# Altium schematic sheet 配套实验板原理图.SchDoc: 单片机综合实验板
size A3; Author: 王东锋; Organization: 空军第一航空学院
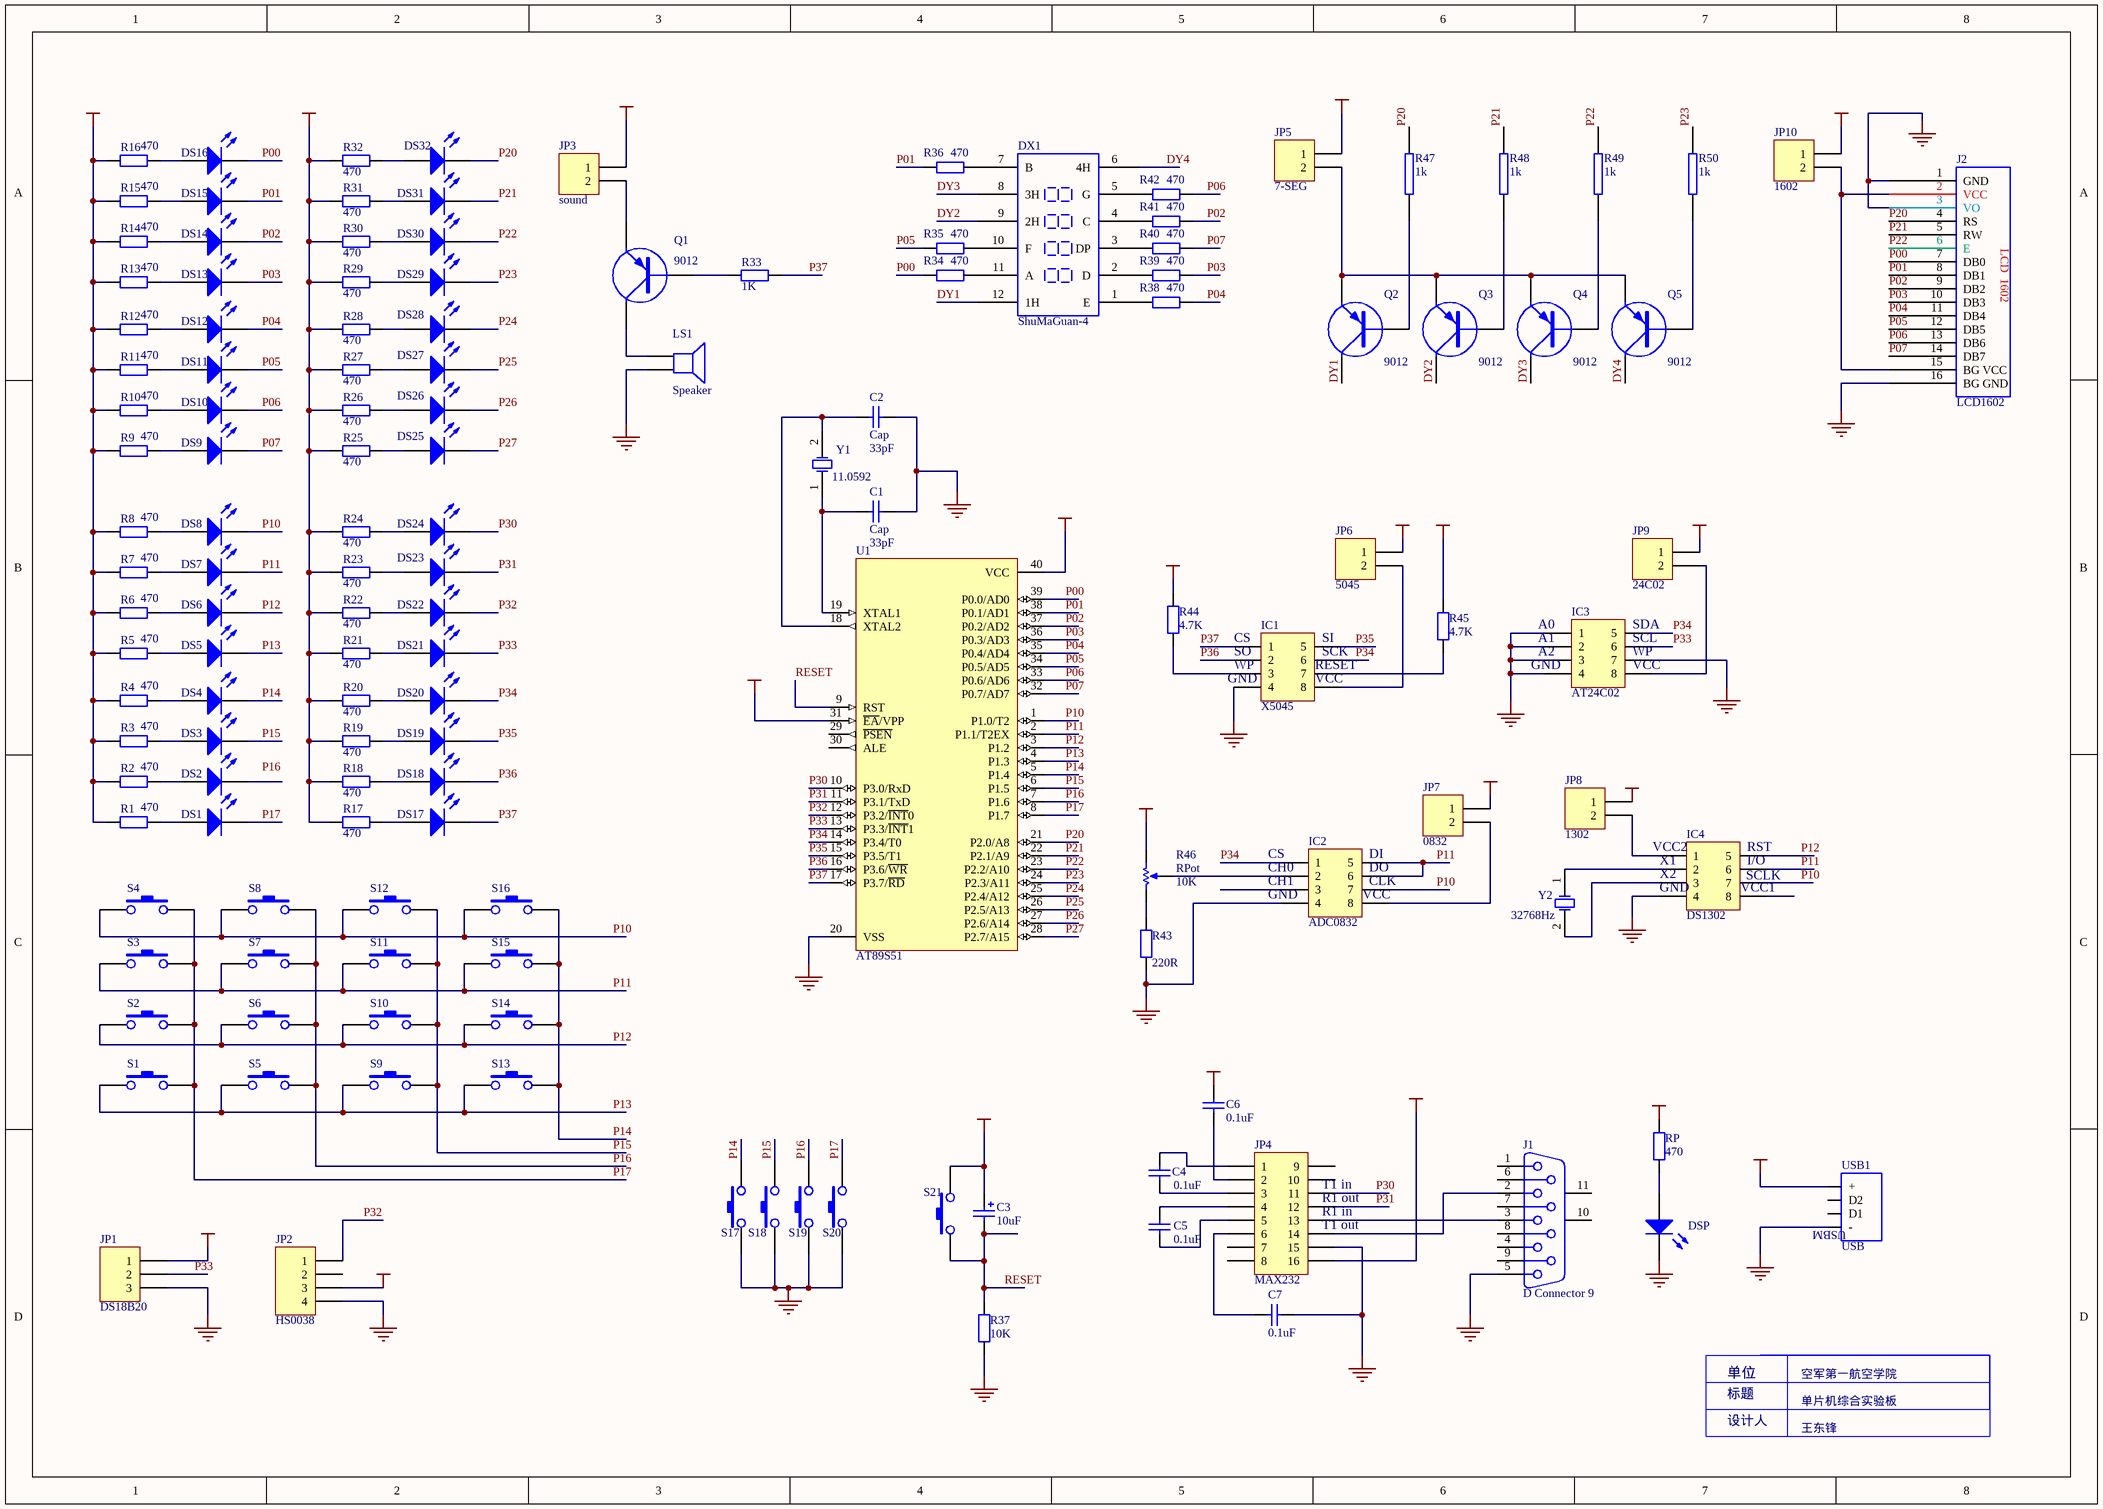
[diagram p0: 配套实验板原理图.SchDoc]

## Parts
C1  Cap  value 33pF  [RAD-0.1]
C2  Cap  value 33pF  [RAD-0.1]
C3  value 10uF  [CAPPR2-5X6.8]
C4  value 0.1uF  [RAD-0.1]
C5  value 0.1uF  [RAD-0.1]
C6  value 0.1uF  [RAD-0.1]
C7  value 0.1uF  [RAD-0.1]
DS1  (no value)  [CAPPR2-5X6.8]
DS2  (no value)  [CAPPR2-5X6.8]
DS3  (no value)  [CAPPR2-5X6.8]
DS4  (no value)  [CAPPR2-5X6.8]
DS5  (no value)  [CAPPR2-5X6.8]
DS6  (no value)  [CAPPR2-5X6.8]
DS7  (no value)  [CAPPR2-5X6.8]
DS8  (no value)  [CAPPR2-5X6.8]
DS9  (no value)  [CAPPR2-5X6.8]
DS10  (no value)  [CAPPR2-5X6.8]
DS11  (no value)  [CAPPR2-5X6.8]
DS12  (no value)  [CAPPR2-5X6.8]
DS13  (no value)  [CAPPR2-5X6.8]
DS14  (no value)  [CAPPR2-5X6.8]
DS15  (no value)  [CAPPR2-5X6.8]
DS16  (no value)  [CAPPR2-5X6.8]
DS17  (no value)  [CAPPR2-5X6.8]
DS18  (no value)  [CAPPR2-5X6.8]
DS19  (no value)  [CAPPR2-5X6.8]
DS20  (no value)  [CAPPR2-5X6.8]
DS21  (no value)  [CAPPR2-5X6.8]
DS22  (no value)  [CAPPR2-5X6.8]
DS23  (no value)  [CAPPR2-5X6.8]
DS24  (no value)  [CAPPR2-5X6.8]
DS25  (no value)  [CAPPR2-5X6.8]
DS26  (no value)  [CAPPR2-5X6.8]
DS27  (no value)  [CAPPR2-5X6.8]
DS28  (no value)  [CAPPR2-5X6.8]
DS29  (no value)  [CAPPR2-5X6.8]
DS30  (no value)  [CAPPR2-5X6.8]
DS31  (no value)  [CAPPR2-5X6.8]
DS32  (no value)  [CAPPR2-5X6.8]
DSP  (no value)  [CAPPR2-5X6.8]
DX1  ShuMaGuan-4  [DIP12 - duplicate]
IC1  X5045  [DIP-8]
IC2  ADC0832  [DIP-8]
IC3  AT24C02  [DIP-8]
IC4  DS1302  [DIP-8]
J1  D Connector 9  [DSUB1.385-2H9]
J2  LCD1602  [HDR1X16]
JP1  DS18B20  [HDR1X3]
JP2  HS0038  [HDR1X4]
JP3  sound  [HDR1X2]
JP4  MAX232  [DIP-16]
JP5  7-SEG  [HDR1X2]
JP6  5045  [HDR1X2]
JP7  0832  [HDR1X2]
JP8  1302  [HDR1X2]
JP9  24C02  [HDR1X2]
JP10  1602  [HDR1X2]
LS1  Speaker  [spk]
Q1  9012  [MJT]
Q2  9012  [MJT]
Q3  9012  [MJT]
Q4  9012  [MJT]
Q5  9012  [MJT]
R1  value 470  [AXIAL-0.4]
R2  value 470  [AXIAL-0.4]
R3  value 470  [AXIAL-0.4]
R4  value 470  [AXIAL-0.4]
R5  value 470  [AXIAL-0.4]
R6  value 470  [AXIAL-0.4]
R7  value 470  [AXIAL-0.4]
R8  value 470  [AXIAL-0.4]
R9  value 470  [AXIAL-0.4]
R10  value 470  [AXIAL-0.4]
R11  value 470  [AXIAL-0.4]
R12  value 470  [AXIAL-0.4]
R13  value 470  [AXIAL-0.4]
R14  value 470  [AXIAL-0.4]
R15  value 470  [AXIAL-0.4]
R16  value 470  [AXIAL-0.4]
R17  value 470  [AXIAL-0.4]
R18  value 470  [AXIAL-0.4]
R19  value 470  [AXIAL-0.4]
R20  value 470  [AXIAL-0.4]
R21  value 470  [AXIAL-0.4]
R22  value 470  [AXIAL-0.4]
R23  value 470  [AXIAL-0.4]
R24  value 470  [AXIAL-0.4]
R25  value 470  [AXIAL-0.4]
R26  value 470  [AXIAL-0.4]
R27  value 470  [AXIAL-0.4]
R28  value 470  [AXIAL-0.4]
R29  value 470  [AXIAL-0.4]
R30  value 470  [AXIAL-0.4]
R31  value 470  [AXIAL-0.4]
R32  value 470  [AXIAL-0.4]
R33  value 1K  [AXIAL-0.4]
R34  value 470  [AXIAL-0.4]
R35  value 470  [AXIAL-0.4]
R36  value 470  [AXIAL-0.4]
R37  value 10K  [AXIAL-0.4]
R38  value 470  [AXIAL-0.4]
R39  value 470  [AXIAL-0.4]
R40  value 470  [AXIAL-0.4]
R41  value 470  [AXIAL-0.4]
R42  value 470  [AXIAL-0.4]
R43  value 220R  [AXIAL-0.4]
R44  value 4.7K  [AXIAL-0.4]
R45  value 4.7K  [AXIAL-0.4]
R46  RPot  value 10K  [VR4]
R47  1k  [AXIAL-0.4]
R48  1k  [AXIAL-0.4]
R49  1k  [AXIAL-0.4]
R50  1k  [AXIAL-0.4]
RP  value 470  [AXIAL-0.4]
S1  (no value)  [AN]
S2  (no value)  [AN]
S3  (no value)  [AN]
S4  (no value)  [AN]
S5  (no value)  [AN]
S6  (no value)  [AN]
S7  (no value)  [AN]
S8  (no value)  [AN]
S9  (no value)  [AN]
S10  (no value)  [AN]
S11  (no value)  [AN]
S12  (no value)  [AN]
S13  (no value)  [AN]
S14  (no value)  [AN]
S15  (no value)  [AN]
S16  (no value)  [AN]
S17  (no value)  [AN]
S18  (no value)  [AN]
S19  (no value)  [AN]
S20  (no value)  [AN]
S21  (no value)  [AN]
U1  AT89S51  [SOT129-1]
USB1  USB  [USB]
Y1  11.0592  [RAD-0.2]
Y2  32768Hz  [RAD-0.2]

## Nets
GND: C1.2 C2.2 C7.1 DSP.2(K) IC1.4 IC2.4 IC3.1 IC3.2 IC3.3 IC3.4 IC3.7 IC4.4 J1.5 J2.1(GND) J2.3(VO) J2.16(BG_GND) JP1.3 JP2.4 JP4.15 LS1.2 R37.1 R43.1 S17.1 S18.1 S19.1 S20.1 U1.20(VSS) USB1.-
VCC: C3.1 C6.1 JP1.1 JP2.3 JP3.1 JP4.16 JP5.1 JP6.1 JP7.1 JP8.1 JP9.1 JP10.1 R1.1 R2.1 R3.1 R4.1 R5.1 R6.1 R7.1 R8.1 R9.1 R10.1 R11.1 R12.1 R13.1 R14.1 R15.1 R16.1 R17.1 R18.1 R19.1 R20.1 R21.1 R22.1 R23.1 R24.1 R25.1 R26.1 R27.1 R28.1 R29.1 R30.1 R31.1 R32.1 R44.2 R45.2 R46.1(TOP) RP.1 S21.2 U1.31(~{EA}/VPP) U1.40(VCC) USB1.+
DY1: DX1.12(1H) Q2.3(C)
DY2: DX1.9(2H) Q3.3(C)
DY3: DX1.8(3H) Q4.3(C)
DY4: DX1.6(4H) Q5.3(C)
P00: DS16.2(K) J2.7(DB0) R34.1 U1.39(P0.0/AD0)
P01: DS15.2(K) J2.8(DB1) R36.1 U1.38(P0.1/AD1)
P02: DS14.2(K) J2.9(DB2) R41.2 U1.37(P0.2/AD2)
P03: DS13.2(K) J2.10(DB3) R39.2 U1.36(P0.3/AD3)
P04: DS12.2(K) J2.11(DB4) R38.2 U1.35(P0.4/AD4)
P05: DS11.2(K) J2.12(DB5) R35.1 U1.34(P0.5/AD5)
P06: DS10.2(K) J2.13(DB6) R42.2 U1.33(P0.6/AD6)
P07: DS9.2(K) J2.14(DB7) R40.2 U1.32(P0.7/AD7)
P10: DS8.2(K) IC2.7 IC4.7 S4.1 S8.1 S12.1 S16.1 U1.1(P1.0/T2)
P11: DS7.2(K) IC2.5 IC2.6 IC4.6 S3.1 S7.1 S11.1 S15.1 U1.2(P1.1/T2EX)
P12: DS6.2(K) IC4.5 S2.1 S6.1 S10.1 S14.1 U1.3(P1.2)
P13: DS5.2(K) S1.1 S5.1 S9.1 S13.1 U1.4(P1.3)
P14: DS4.2(K) S13.2 S14.2 S15.2 S16.2 S17.2 U1.5(P1.4)
P15: DS3.2(K) S9.2 S10.2 S11.2 S12.2 S18.2 U1.6(P1.5)
P16: S5.2 S6.2 S7.2 S8.2 S19.2 U1.7(P1.6)
P17: DS1.2(K) S1.2 S2.2 S3.2 S4.2 S20.2 U1.8(P1.7)
P20: DS32.2(K) J2.4(RS) R47.2 U1.21(P2.0/A8)
P21: DS31.2(K) J2.5(RW) R48.2 U1.22(P2.1/A9)
P22: DS30.2(K) J2.6(E) R49.2 U1.23(P2.2/A10)
P23: DS29.2(K) R50.2 U1.24(P2.3/A11)
P24: DS28.2(K) U1.25(P2.4/A12)
P25: DS27.2(K) U1.26(P2.5/A13)
P26: DS26.2(K) U1.27(P2.6/A14)
P27: DS25.2(K) U1.28(P2.7/A15)
P30: DS24.2(K) JP4.11 U1.10(P3.0/RxD)
P31: DS23.2(K) JP4.12 U1.11(P3.1/TxD)
P32: DS22.2(K) JP2.1 U1.12(P3.2/~{INT}0)
P33: DS21.2(K) IC3.6 JP1.2 U1.13(P3.3/~{INT}1)
P34: DS20.2(K) IC1.6 IC2.1 IC3.5 U1.14(P3.4/T0)
P35: DS19.2(K) IC1.5 U1.15(P3.5/T1)
P36: DS18.2(K) IC1.2 U1.16(P3.6/~{WR})
P37: DS17.2(K) IC1.1 R33.2 U1.17(P3.7/~{RD})
RESET: C3.2 R37.2 S21.1 U1.9(RST)
NetC1_1: C1.1 U1.19(XTAL1) Y1.1(OSC1)
NetC2_1: C2.1 U1.18(XTAL2) Y1.2(OSC2)
NetC4_1: C4.1 JP4.3
NetC4_2: C4.2 JP4.1
NetC5_1: C5.1 JP4.5
NetC5_2: C5.2 JP4.4
NetC6_2: C6.2 JP4.2
NetC7_2: C7.2 JP4.6
NetDS1_1: DS1.1(A) R1.2
NetDS2_1: DS2.1(A) R2.2
NetDS3_1: DS3.1(A) R3.2
NetDS4_1: DS4.1(A) R4.2
NetDS5_1: DS5.1(A) R5.2
NetDS6_1: DS6.1(A) R6.2
NetDS7_1: DS7.1(A) R7.2
NetDS8_1: DS8.1(A) R8.2
NetDS9_1: DS9.1(A) R9.2
NetDS10_1: DS10.1(A) R10.2
NetDS11_1: DS11.1(A) R11.2
NetDS12_1: DS12.1(A) R12.2
NetDS13_1: DS13.1(A) R13.2
NetDS14_1: DS14.1(A) R14.2
NetDS15_1: DS15.1(A) R15.2
NetDS16_1: DS16.1(A) R16.2
NetDS17_1: DS17.1(A) R17.2
NetDS18_1: DS18.1(A) R18.2
NetDS19_1: DS19.1(A) R19.2
NetDS20_1: DS20.1(A) R20.2
NetDS21_1: DS21.1(A) R21.2
NetDS22_1: DS22.1(A) R22.2
NetDS23_1: DS23.1(A) R23.2
NetDS24_1: DS24.1(A) R24.2
NetDS25_1: DS25.1(A) R25.2
NetDS26_1: DS26.1(A) R26.2
NetDS27_1: DS27.1(A) R27.2
NetDS28_1: DS28.1(A) R28.2
NetDS29_1: DS29.1(A) R29.2
NetDS30_1: DS30.1(A) R30.2
NetDS31_1: DS31.1(A) R31.2
NetDS32_1: DS32.1(A) R32.2
NetDSP_1: DSP.1(A) RP.2
NetDX1_1: DX1.1(E) R38.1
NetDX1_2: DX1.2(D) R39.1
NetDX1_3: DX1.3(DP) R40.1
NetDX1_4: DX1.4(C) R41.1
NetDX1_5: DX1.5(G) R42.1
NetDX1_7: DX1.7(B) R36.2
NetDX1_10: DX1.10(F) R35.2
NetDX1_11: DX1.11(A) R34.2
NetIC1_3: IC1.3 R44.1
NetIC1_7: IC1.7 R45.1
NetIC1_8: IC1.8 JP6.2
NetIC2_2: IC2.2 R46.3(TAP)
NetIC2_8: IC2.8 JP7.2
NetIC3_8: IC3.8 JP9.2
NetIC4_1: IC4.1 JP8.2
NetIC4_2: IC4.2 Y2.1(OSC1)
NetIC4_3: IC4.3 Y2.2(OSC2)
NetJ1_2: J1.2 JP4.14
NetJ1_3: J1.3 JP4.13
NetJ2_2: J2.2(VCC) J2.15(BG_VCC) JP10.2
NetJP3_2: JP3.2 Q1.2(E)
NetJP5_2: JP5.2 Q2.2(E) Q3.2(E) Q4.2(E) Q5.2(E)
NetLS1_1: LS1.1 Q1.3(C)
NetQ1_1: Q1.1(B) R33.1
NetQ2_1: Q2.1(B) R47.1
NetQ3_1: Q3.1(B) R48.1
NetQ4_1: Q4.1(B) R49.1
NetQ5_1: Q5.1(B) R50.1
NetR43_2: R43.2 R46.2(BOT)

Not connected (* = marked no-connect by the designer): DS2 2(K); IC2 3; IC4 8; J1 1 4 6 7 8 9 10(MH1) 11(MH2); JP2 2; JP4 7 8 9 10; U1 29(~{PSEN}) 30(ALE); USB1 D1 D2

## Notes on the sheet
- (near IC1) CS
- (near IC1) SI
- (near IC3) A0
- (near IC3) A1
- (near IC3) SCL
- (near IC3) SDA
- (near IC1) GND
- (near IC1) SO
- (near IC1) WP
- (near IC1) VCC
- (near IC1) RESET
- (near IC1) SCK
- (near IC3) GND
- (near IC3) A2
- (near IC3) VCC
- (near IC3) WP
- (near IC2) CS
- (near IC2) DI
- (near IC4) VCC2
- (near IC4) RST
- (near IC2) CH0
- (near IC2) CH1
- (near IC2) GND
- (near IC2) VCC
- (near IC2) DO
- (near IC2) CLK
- (near IC4) X1
- (near IC4) X2
- (near IC4) GND
- (near IC4) VCC1
- (near IC4) SCLK
- (near IC4) I/O
- (near JP4) T1 in
- (near JP4) R1 in
- (near JP4) T1 out
- (near JP4) R1 out
- Labels drawn without touching a wire or pin: P16
- 单位
- 标题
- 设计人
- (in symbol LCD1602) LCD  1602
- (in symbol USB) USBM

## Library data of the parts
C1 C2 C4-C7 = Cap: Capacitor; Published: 8-Jun-2000; Revision: July-2002: Re-released for DXP Platform.; Publisher: Altium Limited
C3 = Cap Pol1: Polarized Capacitor (Radial); Published: 8-Jun-2000; Revision: July-2002: Re-released for DXP Platform.; Publisher: Altium Limited
DS1-DS32 DSP = LED0: Typical INFRARED GaAs LED; Published: 8-Jun-2000; Revision: July-2002: Re-released for DXP Platform.; Publisher: Altium Limited
DX1 = 84
IC1-IC4 = Header 4X2A: Header, 4-Pin, Dual row; Revision: 17-Jul-2002: Re-released for DXP Platform.; Publisher: Altium Limited
J1 = D Connector 9: Receptacle Assembly, 9 Position, Right Angle; Package Information: Latest Revision: O; Positions: 9; Published: 15-Jun-2001; Revision: 17-Jul-2002: Re-released for DXP Platform.; Datasheet: (1-Sep-1999); Package Reference: 788750; Publisher: Altium Limited; Orientation: Right Angle; Gender: Receptacle
JP1 = Header 3: Header, 3-Pin; Revision: 17-Jul-2002: Re-released for DXP Platform.; Publisher: Altium Limited
JP2 = Header 4: Header, 4-Pin; Revision: 17-Jul-2002: Re-released for DXP Platform.; Publisher: Altium Limited
JP3 JP5-JP10 = Header 2: Header, 2-Pin; Revision: 17-Jul-2002: Re-released for DXP Platform.; Publisher: Altium Limited
JP4 = Header 8X2A: Header, 8-Pin, Dual row; Revision: 17-Jul-2002: Re-released for DXP Platform.; Publisher: Altium Limited
LS1 = Speaker: Loudspeaker; Published: 24-Mar-1999; Revision: July-2002: Re-released for DXP Platform.; Publisher: Altium Limited
Q1-Q5 = PNP: PNP Transistor
R1-R45 RP = Res2: Resistor; Published: 8-Jun-2000; Revision: July-2002: Re-released for DXP Platform.; Publisher: Altium Limited
R46 = RPot: Potentiometer; Set Position: 0.5; Published: 8-Jun-2000; Revision: July-2002: Re-released for DXP Platform.; Publisher: Altium Limited
R47-R50 = RES2
S1-S21 = SW-PB
U1 = P89C58X2BN: 80C51 8-Bit Flash Microcontroller Family, 32 kB Flash; Package Information: Latest Revision: Aug-2000; Code - JEDEC: MO-015; Published: 21-May-2003; Datasheet: Latest Revision: 5-Jun-2002; Package Reference: SOT129-1; Publisher: Altium Limited
Y1 Y2 = XTAL: Crystal Oscillator; Published: 8-Jun-2000; Revision: July-2002: Re-released for DXP Platform.; Publisher: Altium Limited